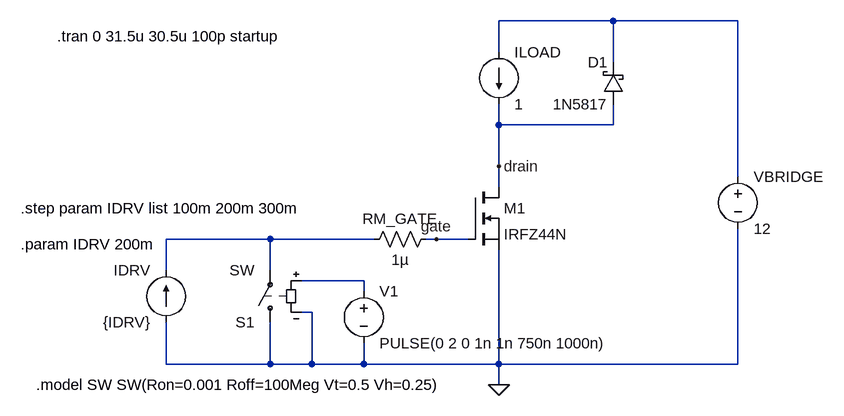
[diagram p0: schematic tb_GateCharge.asc]
tb_GateCharge.asc, the LTspice schematic file:
Version 4.1
SHEET 1 880 680
WIRE 528 -160 352 -160
WIRE 720 -160 528 -160
WIRE 352 -112 352 -160
WIRE 528 -96 528 -160
WIRE 352 0 352 -32
WIRE 528 0 528 -32
WIRE 528 0 352 0
WIRE 352 64 352 0
WIRE 720 80 720 -160
WIRE 352 96 352 64
WIRE 0 176 -160 176
WIRE 160 176 0 176
WIRE 256 176 240 176
WIRE 304 176 256 176
WIRE -160 224 -160 176
WIRE 0 224 0 176
WIRE 144 240 48 240
WIRE 144 256 144 240
WIRE 64 288 48 288
WIRE -160 368 -160 304
WIRE 0 368 0 304
WIRE 0 368 -160 368
WIRE 64 368 64 288
WIRE 64 368 0 368
WIRE 144 368 144 336
WIRE 144 368 64 368
WIRE 352 368 352 192
WIRE 352 368 144 368
WIRE 720 368 720 160
WIRE 720 368 352 368
WIRE 352 400 352 368
FLAG 352 400 0
FLAG 256 176 gate
FLAG 352 64 drain
SYMBOL nmos 304 96 R0
SYMATTR InstName M1
SYMATTR Value IRFZ44N
SYMBOL current -160 304 R180
WINDOW 0 24 80 Left 2
WINDOW 3 24 0 Left 2
WINDOW 123 0 0 Left 0
WINDOW 39 0 0 Left 0
SYMATTR InstName IDRV
SYMATTR Value {IDRV}
SYMBOL sw 0 320 R180
SYMATTR InstName S1
SYMBOL voltage 144 240 R0
WINDOW 123 0 0 Left 0
WINDOW 39 0 0 Left 0
SYMATTR InstName V1
SYMATTR Value PULSE(0 2 0 1n 1n 750n 1000n)
SYMBOL current 352 -112 R0
WINDOW 123 0 0 Left 0
WINDOW 39 0 0 Left 0
SYMATTR InstName ILOAD
SYMATTR Value 1
SYMBOL voltage 720 64 R0
WINDOW 123 0 0 Left 0
WINDOW 39 0 0 Left 0
SYMATTR InstName VBRIDGE
SYMATTR Value 12
SYMBOL schottky 544 -32 R180
WINDOW 0 24 64 Left 2
WINDOW 3 24 0 Left 2
SYMATTR InstName D1
SYMATTR Value 1N5817
SYMATTR Description Diode
SYMATTR Type diode
SYMBOL res 256 160 R90
WINDOW 0 0 56 VBottom 2
WINDOW 3 32 56 VTop 2
SYMATTR InstName RM_GATE
SYMATTR Value 1µ
TEXT -360 400 Left 2 !.model SW SW(Ron=0.001 Roff=100Meg Vt=0.5 Vh=0.25)
TEXT -328 -136 Left 2 !.tran 0 31.5u 30.5u 100p startup
TEXT -384 184 Left 2 !.param IDRV 200m
TEXT -384 128 Left 2 !.step param IDRV list 100m 200m 300m

The netlist it stands for:
* tb_GateCharge.asc
M1 drain gate 0 0 IRFZ44N
IDRV 0 N002 {IDRV}
S1 0 N002 N003 0 SW
V1 N003 0 PULSE(0 2 0 1n 1n 750n 1000n)
ILOAD N001 drain 1
VBRIDGE N001 0 12
D1 drain N001 1N5817
RM_GATE gate N002 1µ
.model D D
.lib standard.dio
.model NMOS NMOS
.model PMOS PMOS
.lib standard.mos
.model SW SW(Ron=0.001 Roff=100Meg Vt=0.5 Vh=0.25)
.tran 0 31.5u 30.5u 100p startup
.param IDRV 200m
.step param IDRV list 100m 200m 300m
.backanno
.end